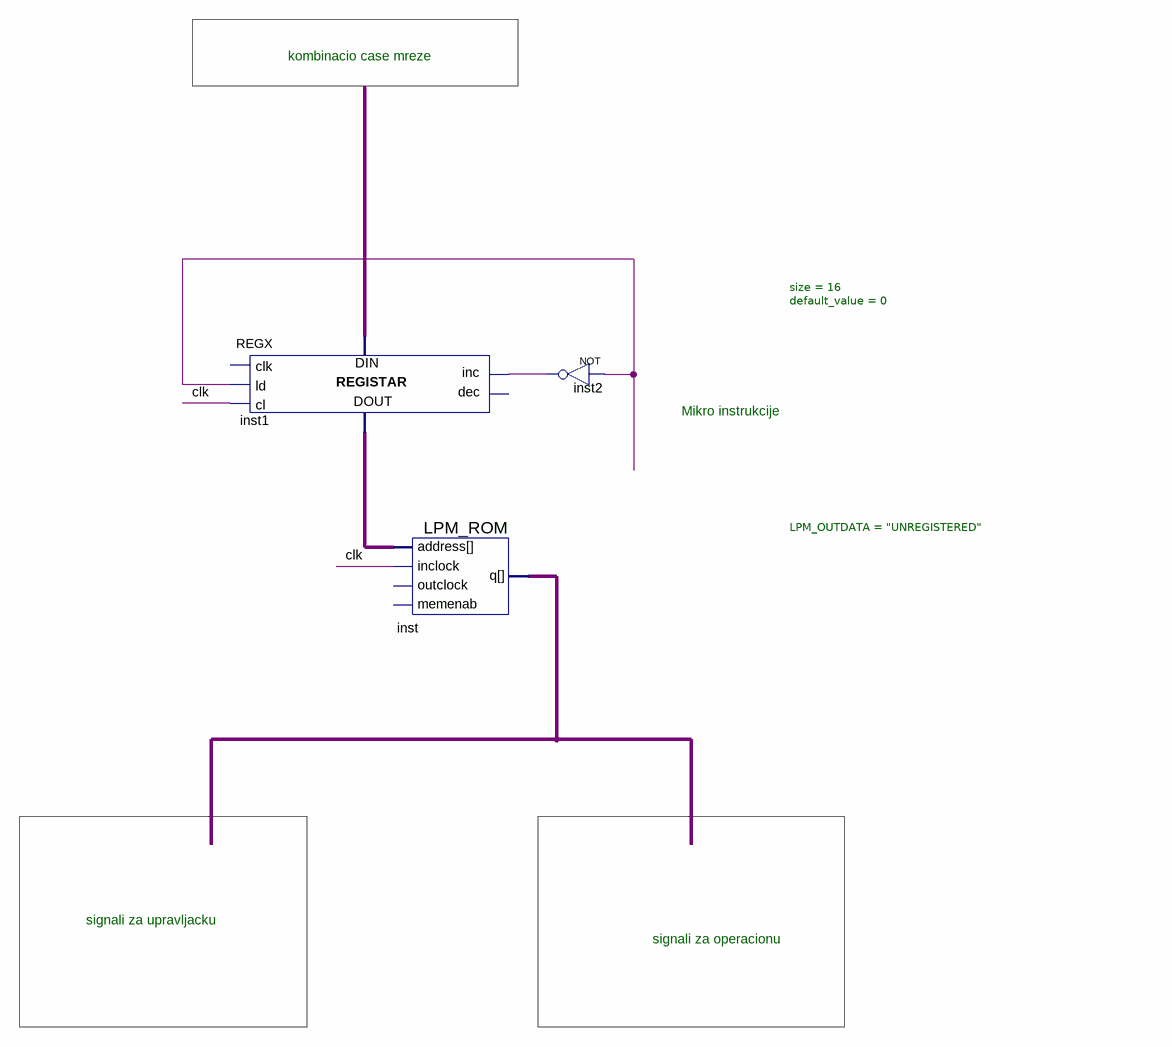
[diagram p0: schematic sheet]
// Quartus schematic cpu_upravljacka.bdf as structural Verilog: 3 symbols, 0 pins
module cpu_upravljacka (
);

  wire clk, inst2_out, inst_q, undriven;
  wire [15:0] inst1_data_out, undriven_2;

  REGX #(.size(16), .default_value(0)) inst1 (
    .ld(undriven), .cl(clk), .inc(inst2_out), .data_in(undriven_2), .data_out(inst1_data_out));  // open: clk, dec
  LPM_ROM #(.LPM_OUTDATA("UNREGISTERED")) inst (
    .address(inst1_data_out), .inclock(clk), .q(inst_q));  // open: outclock, memenab
  not inst2 (inst2_out, undriven);

  // Notes on the sheet:
  //   kombinacio case mreze
  //   Mikro instrukcije
  //   signali za upravljacku
  //   signali za operacionu
endmodule
